# EAGLE design Rev A (EAGLE 6.4)
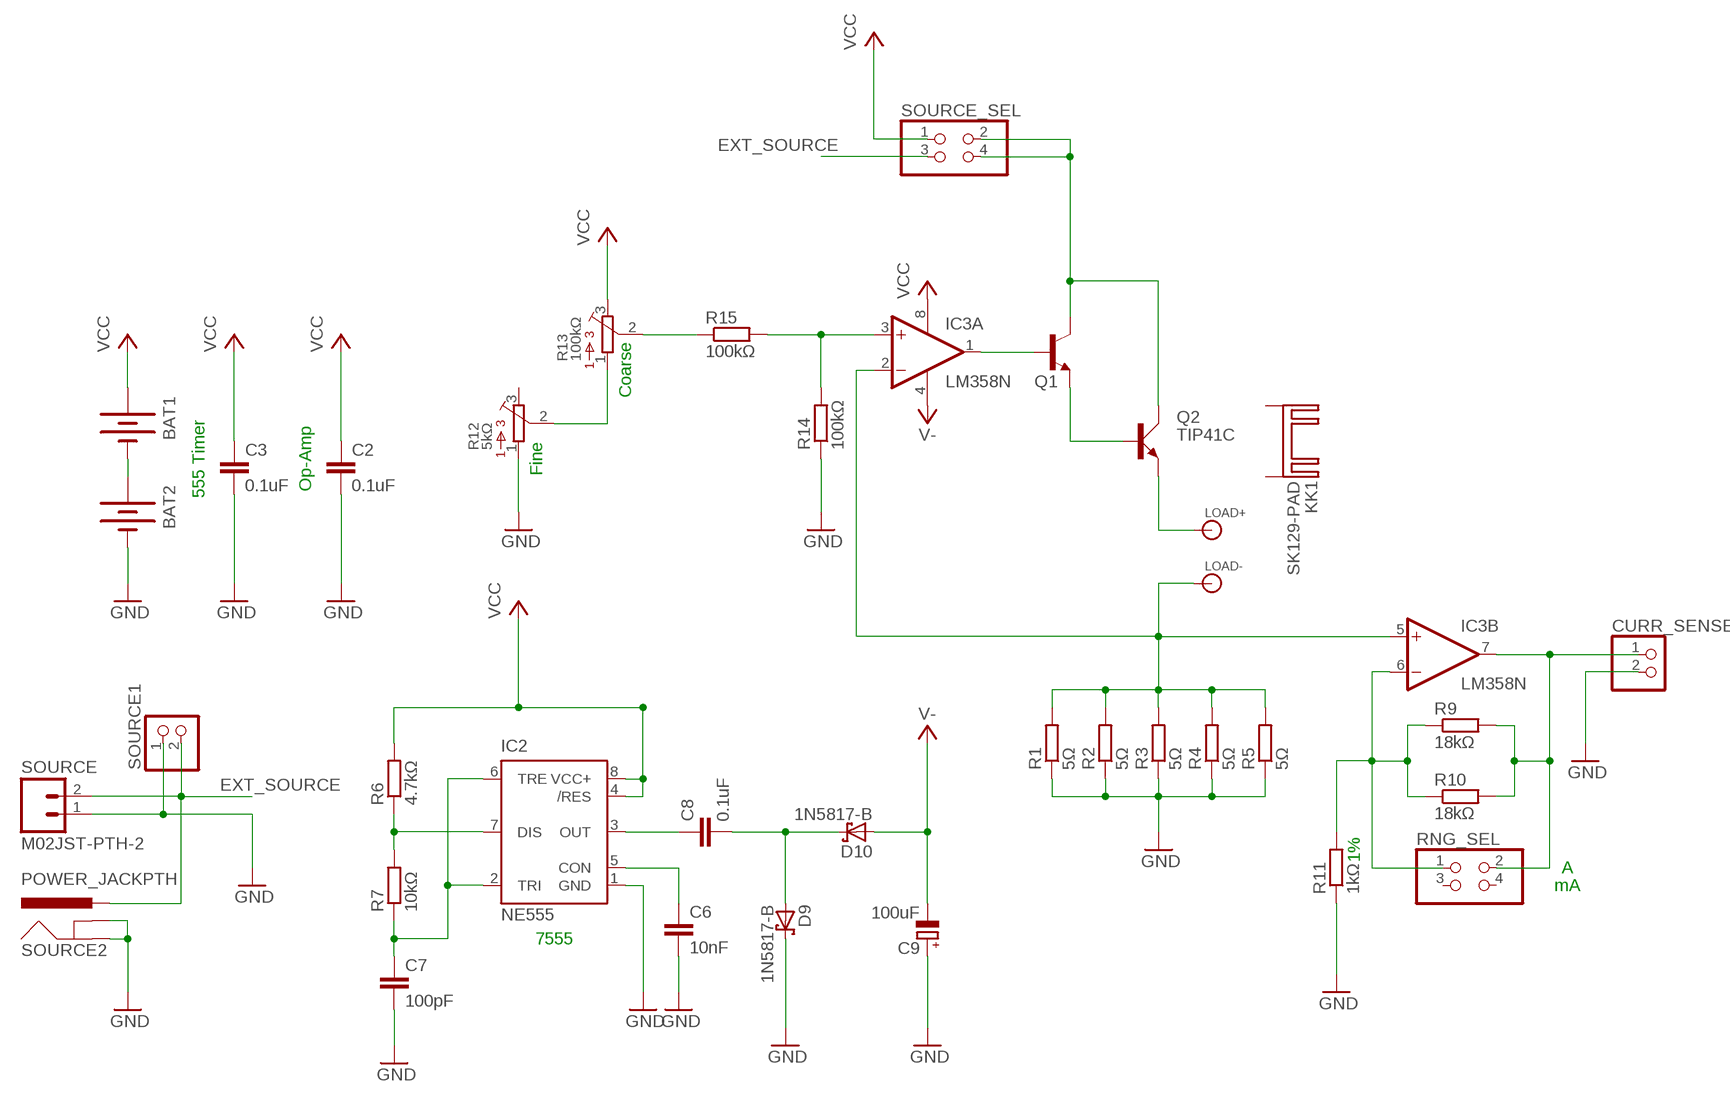
[diagram p0: schematic, sheet 1]

## Parts
BAT1  BATTERYAA  [BATTERY-AA]
BAT2  BATTERYAA  [BATTERY-AA]
C2  0.1uF  C-EU050-025X075  [C050-025X075]
C3  0.1uF  C-EU050-025X075  [C050-025X075]
C6  10nF  C-EU050-025X075  [C050-025X075]
C7  100pF  C-EU025-025X050  [C025-025X050]
C8  0.1uF  C-EU050-025X075  [C050-025X075]
C9  100uF  CPOL-EUE2.5-6  [E2,5-6]
CURR_SENSE  PINHD-1X2  [1X02]
D9  1N5817-B  [DO41-7.6]
D10  1N5817-B  [DO41-7.6]
IC2  NE555  [DIL-08]
IC3  LM358N  [DIL08]
KK1  SK129-PAD  [SK129]
LOAD+  BANANA_CONN  [BANANA_CONN]
LOAD-  BANANA_CONN  [BANANA_CONN]
Q1  2N5551-NPN-TO92-CBE  [TO92-CBE]
Q2  TIP41C  [TO220AV]
R1  5Ω  R-EU_0613/15  [P0613/15]
R2  5Ω  R-EU_0613/15  [P0613/15]
R3  5Ω  R-EU_0613/15  [P0613/15]
R4  5Ω  R-EU_0613/15  [P0613/15]
R5  5Ω  R-EU_0613/15  [P0613/15]
R6  4.7kΩ  R-EU_0207/10  [0207/10]
R7  10kΩ  R-EU_0207/10  [0207/10]
R9  18kΩ  R-EU_0207/10  [0207/10]
R10  18kΩ  R-EU_0207/10  [0207/10]
R11  1kΩ  R-EU_0207/10  [0207/10]
R12  5kΩ  3362U  [3362U]
R13  100kΩ  3362U  [3362U]
R14  100kΩ  R-EU_0207/10  [0207/10]
R15  100kΩ  R-EU_0207/10  [0207/10]
RNG_SEL  PINHD-2X2  [2X02]
SOURCE  M02JST-PTH-2  [JST-2-PTH]
SOURCE1  PINHD-1X2  [1X02]
SOURCE2  POWER_JACKPTH  [POWER_JACK_PTH]
SOURCE_SEL  PINHD-2X2  [2X02]

## Nets
CURR_SENSE: IC3.2(A:-IN) IC3.5(B:+IN) LOAD-.P$1 R1.2 R2.2 R3.2 R4.2 R5.2
EXT_SOURCE: SOURCE1.2 SOURCE2.PWR SOURCE.2 SOURCE_SEL.3
GND: BAT2.GND@1(-) C2.2 C3.2 C6.2 C7.2 C9.+ CURR_SENSE.2 D9.C IC2.1(GND) R1.1 R2.1 R3.1 R4.1 R5.1 R11.1 R12.1 R14.1 SOURCE1.1 SOURCE2.GND SOURCE2.GNDBREAK SOURCE.1
N$1: IC3.1(A:OUT) Q1.B
N$2: Q1.E Q2.B
N$3: Q1.C Q2.C SOURCE_SEL.2 SOURCE_SEL.4
N$4: LOAD+.P$1 Q2.E
N$5: R12.2 R13.1
N$7: IC3.3(A:+IN) R14.2 R15.2
N$8: IC3.6(B:-IN) R9.1 R10.1 R11.2 RNG_SEL.1
N$9: CURR_SENSE.1 IC3.7(B:OUT) R9.2 R10.2 RNG_SEL.2
N$10: BAT1.GND@1(-) BAT2.PWR@1(+)
N$11: R13.2 R15.1
N$17: C8.1 IC2.3(OUT)
N$18: C6.1 IC2.5(CON)
N$19: C7.1 IC2.2(TRI) IC2.6(TRE) R7.1
N$20: IC2.7(DIS) R6.1 R7.2
N$25: C8.2 D9.A D10.C
V-: C9.- D10.A IC3.4(P:V-)
VCC: BAT1.PWR@1(+) C2.1 C3.1 IC2.4(/RES) IC2.8(VCC+) IC3.8(P:V+) R6.2 R13.3 SOURCE_SEL.1
Unconnected: KK1.A2,5(K) KK1.B2,5(K) R12.3 RNG_SEL.3 RNG_SEL.4

## Notes on the sheet
- Coarse
- 555 Timer | Op-Amp | Fine
- 1%
- A
- mA
- 7555

## Library data of the parts
BAT1 BAT2 = SparkFun-Electromechanical:BATTERY: Battery Holders Various common sizes : AA, AAA, 20mm coin cell and 12mm coin cell. 20MM_4LEGS, BATT-10373
C2 C3 C6-C8 = rcl:C-EU: CAPACITOR, European symbol
C9 = rcl:CPOL-EU: POLARIZED CAPACITOR, European symbol
CURR_SENSE SOURCE1 = pinhead:PINHD-1X2: PIN HEADER
D9 D10 = diode:1N581*: 1.0A SCHOTTKY BARRIER RECTIFIER Source: http://www.diodes.com/datasheets/ds23001.pdf
IC2 = st-microelectronics:NE555: General purpose bipolar Timer; MF: Arrow Electronics; MPN: NE555N; OC_FARNELL: 1467742; OC_NEWARK: 89K1486
IC3 = linear:LM358: OP AMP also LM158; LM258; LM2904 Source: http://cache.national.com/ds/LM/LM158.pdf
KK1 = heatsink:SK129-PAD: HEATSINK manufacturer Fischer/distributor Buerklin
LOAD+ LOAD- = SparkFun-Connectors:BANANA_CONN: Through-hole banana jack
Q1 = transistor:*-NPN-: NPN Transistror BF959 corrected 2008.03.06
Q2 = transistor-power:TIP41C: NPN TRANSISTOR
R1-R5 = rcl:R-EU_: RESISTOR, European symbol
R6 R7 R9-R11 R14 R15 = resistor:R-EU_: RESISTOR, European symbol
R12 R13 = bourns:3362: 3362 Series 1/4" Square Trimmer
RNG_SEL SOURCE_SEL = pinhead:PINHD-2X2: PIN HEADER
SOURCE = SparkFun-Connectors:M02: Standard 2-pin 0.1" header. Use with - straight break away headers ( PRT-00116) - right angle break away headers (PRT-00553) - swiss pins (PRT-00743) - machine pins (PRT-00117) - female headers (PRT-00115) Molex polarized connector foot print use with: PRT-08233 with associated crimp pins and housings. 2.54_SCREWTERM for use with PRT-10571. 3.5mm Screw Terminal footprints for PRT-08084 5mm Screw Terminal footprints for use with PRT-08433
SOURCE2 = SparkFun-Connectors:POWER_JACK: Power Jack This is the standard 5.5mm barrel jack for power. The PTH is the most common, proven, reliable, footprint. The Slot footprint only works if the mill layer is transmitted to the PCB fab house so be warned. Spark Fun Electronics SKU : PRT-00119 SMT: CONN-08106 Mating wall wart : TOL-00298 (and others)

## Board
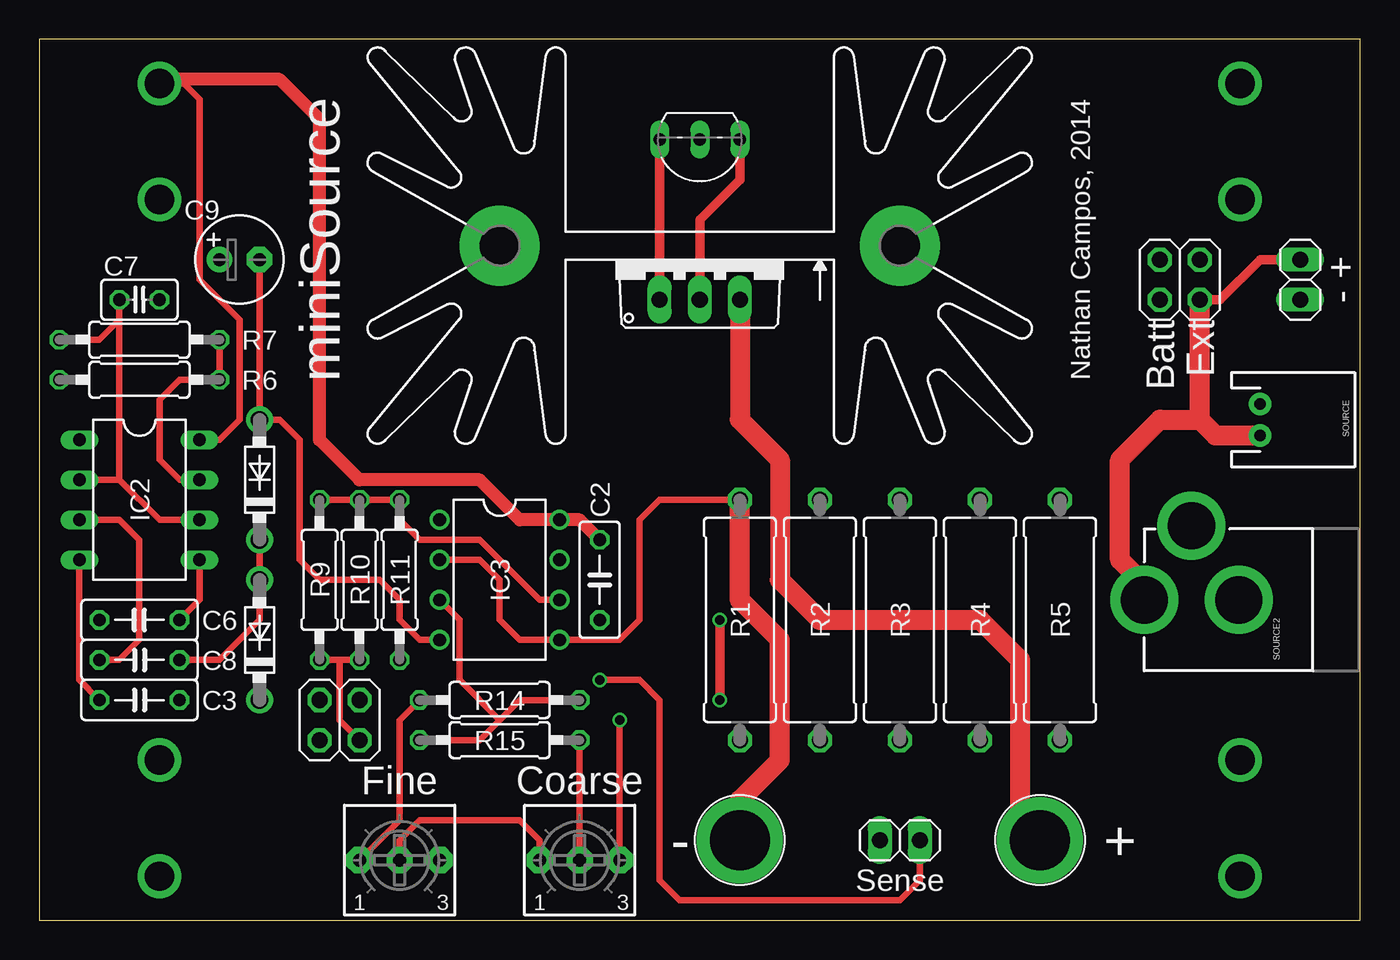
[diagram p1: board, top side]
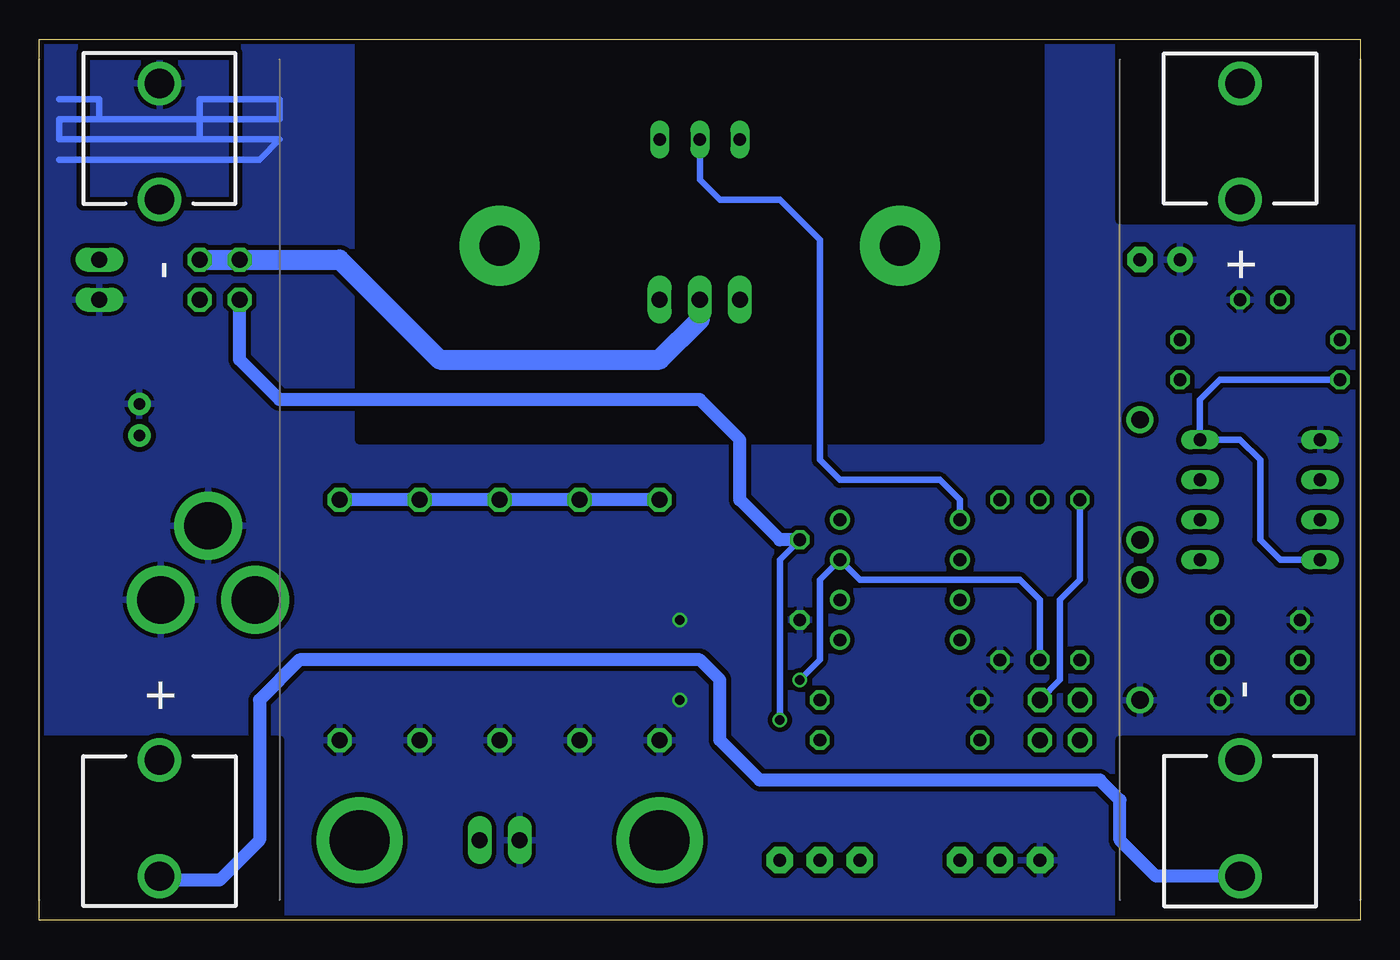
[diagram p2: board, bottom side, seen from below]

Size 83.82 x 55.88 mm. Coordinates in mm from the lower left corner, seen from the top.
Outline: 0,0 83.82,0 83.82,55.88 0,55.88 0,0
Copper layers (1*2*15*16): Top 0.035mm / dielectric 0.2mm / Route2 0.0175mm / dielectric 1.1mm / Route15 0.0175mm / dielectric 0.2mm / Bottom 0.035mm
Design rules "SeeedStudio_DRU_no_angle_20130527": minimum track width 6mil, minimum drill 12mil, track to track 6mil, track to pad 6mil, pad to pad 6mil, via to via 6mil, smd to smd 0mil, copper to edge 10mil, drill to drill 10mil, minimum pad ring 6mil, minimum via ring 6mil, stop-mask expansion 2mil, vias tented up to drill 25mil, thermal gap 10mil
bRestrict: area 20.3,30.5 to 63.5,55.9; area 0,44.5 to 15.2,55.9; area 0,0 to 15.2,11.4; area 68.6,0 to 83.8,11.4

### Footprints (pad centres in the part's own frame; a part is rotated, then mirrored left to right if it is on the bottom)
BATTERY-AA = drill 1.854: GND@1 25.146,0; GND@2 17.78,0; PWR@1 -25.146,0; PWR@2 -17.78,0
C050-025X075 = drill 0.813 octagon: 1 -2.54,0; 2 2.54,0
C025-025X050 = drill 0.813 octagon: 1 -1.27,0; 2 1.27,0
E2,5-6 = drill 0.813 pad 1.6: + -1.27,0 | drill 0.813 pad 1.6 octagon: - 1.27,0
1X02 = drill 1.016 long: 1 -1.27,0; 2 1.27,0
DO41-7.6 = drill 1.1 pad 1.7: A 3.81,0; C -3.81,0
DIL-08 = drill 0.813 long: 1 -3.81,-3.81; 2 -1.27,-3.81; 3 1.27,-3.81; 4 3.81,-3.81; 5 3.81,3.81; 6 1.27,3.81; 7 -1.27,3.81; 8 -3.81,3.81
DIL08 = drill 0.813 pad 1.27: 1 -3.81,-3.81; 2 -1.27,-3.81; 3 1.27,-3.81; 4 3.81,-3.81; 5 3.81,3.81; 6 1.27,3.81; 7 -1.27,3.81; 8 -3.81,3.81
SK129 = drill 2.54 pad 5.08: A2,5 -12.7,-0.889; B2,5 12.7,-0.889
BANANA_CONN = drill 3.81 pad 5.461: P$1 0,0
TO92-CBE = drill 0.813 long: B 0,0; C -2.54,0; E 2.54,0
TO220AV = drill 1.016 long: B -2.54,-2.54; C 0,-2.54; E 2.54,-2.54
P0613/15 = drill 1.016 octagon: 1 -7.62,0; 2 7.62,0
0207/10 = drill 0.813 octagon: 1 -5.08,0; 2 5.08,0
3362U = drill 0.813 pad 1.676 octagon: 1 -2.54,0; 2 0,0; 3 2.54,0
2X02 = drill 1.016 octagon: 1 -1.27,-1.27; 2 -1.27,1.27; 3 1.27,-1.27; 4 1.27,1.27
JST-2-PTH = drill 0.7 pad 1.448: 1 -1,0; 2 1,0
POWER_JACK_PTH = drill 2.997 pad 4.318: GND 0,7.7; GNDBREAK 4.7,10.7; PWR 0,13.7

### Placement (x,y rotation side)
BAT1  7.62,27.94 270 bottom
BAT2  76.2,27.94 90 bottom
C2  35.56,21.59 270 top
C3  6.35,13.97 0 top
C6  6.35,19.05 180 top
C7  6.35,39.37 0 top
C8  6.35,16.51 0 top
C9  12.7,41.91 0 top
CURR_SENSE  54.61,5.08 180 top
D9  13.97,17.78 90 top
D10  13.97,27.94 90 top
IC2  6.35,26.67 270 top
IC3  29.21,21.59 270 top
KK1  41.91,41.91 180 top
LOAD+  63.5,5.08 0 top
LOAD-  44.45,5.08 0 top
Q1  41.91,49.53 180 top
Q2  41.91,41.91 0 top
R1  44.45,19.05 90 top
R2  49.53,19.05 90 top
R3  54.61,19.05 90 top
R4  59.69,19.05 90 top
R5  64.77,19.05 90 top
R6  6.35,34.29 180 top
R7  6.35,36.83 0 top
R9  17.78,21.59 270 top
R10  20.32,21.59 270 top
R11  22.86,21.59 90 top
R12  22.86,3.81 0 top
R13  34.29,3.81 0 top
R14  29.21,13.97 0 top
R15  29.21,11.43 180 top
RNG_SEL  19.05,12.7 180 top
SOURCE  77.47,31.75 270 top
SOURCE1  80.01,40.64 90 top
SOURCE2  83.82,20.32 90 top
SOURCE_SEL  72.39,40.64 0 top

### Tracks (layer width: path | path; a pad name or v marks a point on that pad's centre or on a via)
CURR_SENSE
  Top 0.406: IC3.2 27.94,22.86 29.21,21.59 29.21,19.05 30.48,17.78 IC3.5 36.83,17.78 38.1,19.05 38.1,25.4 39.37,26.67 R1.2
  Top 1.27: LOAD-.P$1 44.45,7.62 46.99,10.16 46.99,17.78 44.45,20.32 R1.2
  Bottom 0.813: R1.2 R2.2 R3.2 R4.2 R5.2
EXT_SOURCE
  Top 0.61: SOURCE1.2 77.47,41.91 74.93,39.37 SOURCE_SEL.3
  Top 1.27: SOURCE.2 74.66,30.75 73.66,31.75 | 73.66,31.75 SOURCE_SEL.3 | SOURCE2.PWR 70.12,21.32 68.58,22.86 68.58,29.21 71.12,31.75 73.66,31.75
GND  (via drill 0.6)
  Top 0.406: R14.1 22.86,12.7 22.86,6.35 R12.1
  Top 0.61: v43.18,19.05 v43.18,13.97
  Bottom 0.406: 82.55,48.26 69.85,48.26 68.58,49.53 73.66,49.53 | 80.01,50.8 68.58,50.8 68.58,52.07 73.66,52.07 73.66,49.53 | 73.66,49.53 82.55,49.53 82.55,50.8 80.01,50.8 | 80.01,50.8 80.01,52.07 82.55,52.07
  pour Bottom (isolate 0.305): 0,55.88 83.82,55.88 83.82,0 0,0
N$1
  Bottom 0.406: IC3.1 25.4,26.67 26.67,27.94 33.02,27.94 34.29,29.21 34.29,43.18 36.83,45.72 40.64,45.72 41.91,46.99 Q1.B
N$2
  Top 0.61: Q1.E Q2.B
N$3
  Top 0.61: Q1.C 44.45,46.99 41.91,44.45 Q2.C
  Bottom 1.27: Q2.C 41.91,38.1 44.45,35.56 58.42,35.56 64.77,41.91 SOURCE_SEL.2 SOURCE_SEL.4
N$4
  Top 1.27: Q2.E 44.45,31.75 46.99,29.21 46.99,21.59 49.53,19.05 59.69,19.05 62.23,16.51 62.23,6.35 LOAD+.P$1
N$5
  Top 0.406: R12.2 22.86,5.08 24.13,6.35 30.48,6.35 31.75,5.08 R13.1
N$7
  Top 0.406: R15.2 27.94,11.43 29.21,12.7 | 29.21,12.7 30.48,13.97 R14.2 | IC3.3 26.67,19.05 26.67,15.24 29.21,12.7
N$8
  Top 0.406: R9.1 R10.1 R11.2 22.86,25.4 24.13,24.13 27.94,24.13 31.75,20.32 IC3.6
  Bottom 0.406: RNG_SEL.1 19.05,15.24 19.05,20.32 17.78,21.59 R9.1
N$9  (via drill 0.6)
  Top 0.406: R9.2 19.05,16.51 | 19.05,16.51 R10.2 | v35.56,15.24 38.1,15.24 39.37,13.97 39.37,2.54 40.64,1.27 54.61,1.27 55.88,2.54 CURR_SENSE.1 | RNG_SEL.2 19.05,12.7 19.05,16.51
  Bottom 0.406: R10.2 20.32,20.32 21.59,21.59 31.75,21.59 IC3.7 34.29,21.59 34.29,16.51 v35.56,15.24
N$10
  Bottom 0.813: BAT1.GND@1 12.95,2.79 15.24,5.08 15.24,7.62 16.51,8.89 38.1,8.89 40.64,11.43 40.64,15.24 41.91,16.51 67.31,16.51 69.85,13.97 69.85,5.08 72.39,2.54 75.95,2.54 BAT2.PWR@1
N$11
  Top 0.406: R15.1 R13.2
N$17
  Top 0.406: C8.1 5.08,16.51 6.35,17.78 6.35,24.13 5.08,25.4 IC2.3
N$18
  Top 0.406: C6.1 10.16,20.32 IC2.5
N$19
  Top 0.406: IC2.6 7.62,25.4 5.08,27.94 | 5.08,27.94 IC2.2 | R7.1 3.81,36.83 5.08,38.1 C7.1 5.08,27.94
N$20
  Top 0.406: IC2.7 8.89,27.94 7.62,29.21 7.62,33.02 8.89,34.29 R6.1 R7.2
N$25
  Top 0.406: C8.2 11.43,16.51 13.97,19.05 D9.A D10.C
V-
  Top 0.406: C9.- D10.A 15.24,31.75 16.51,30.48 16.51,22.86 17.78,21.59 21.59,21.59 22.86,20.32 22.86,19.05 24.13,17.78 IC3.4
VCC  (via drill 0.6)
  Top 0.406: IC2.8 11.43,30.48 12.7,31.75 12.7,38.1 10.16,40.64 10.16,52.07 9.14,53.09 BAT1.PWR@1 | C3.1 2.54,15.24 IC2.4 | R13.3 v36.83,12.7
  Top 0.813: BAT1.PWR@1 7.87,53.34 15.24,53.34 17.78,50.8 17.78,30.48 20.32,27.94 27.94,27.94 30.48,25.4 IC3.8 34.29,25.4 C2.1
  Bottom 0.406: R6.2 8.89,34.29 10.16,33.02 IC2.8 7.62,30.48 6.35,29.21 6.35,24.13 5.08,22.86 IC2.4 | v36.83,12.7 36.83,22.86 C2.1
  Bottom 0.813: C2.1 36.83,24.13 39.37,26.67 39.37,30.48 41.91,33.02 68.58,33.02 71.12,35.56 SOURCE_SEL.1

### Text on the board
tPlace: miniSource | Nathan Campos, 2014 | - + | Batt | Ext | Fine | Coarse | - | + | Sense